# EAGLE schematic table_tiles (EAGLE 5.11)

## Sheet 1 of 2
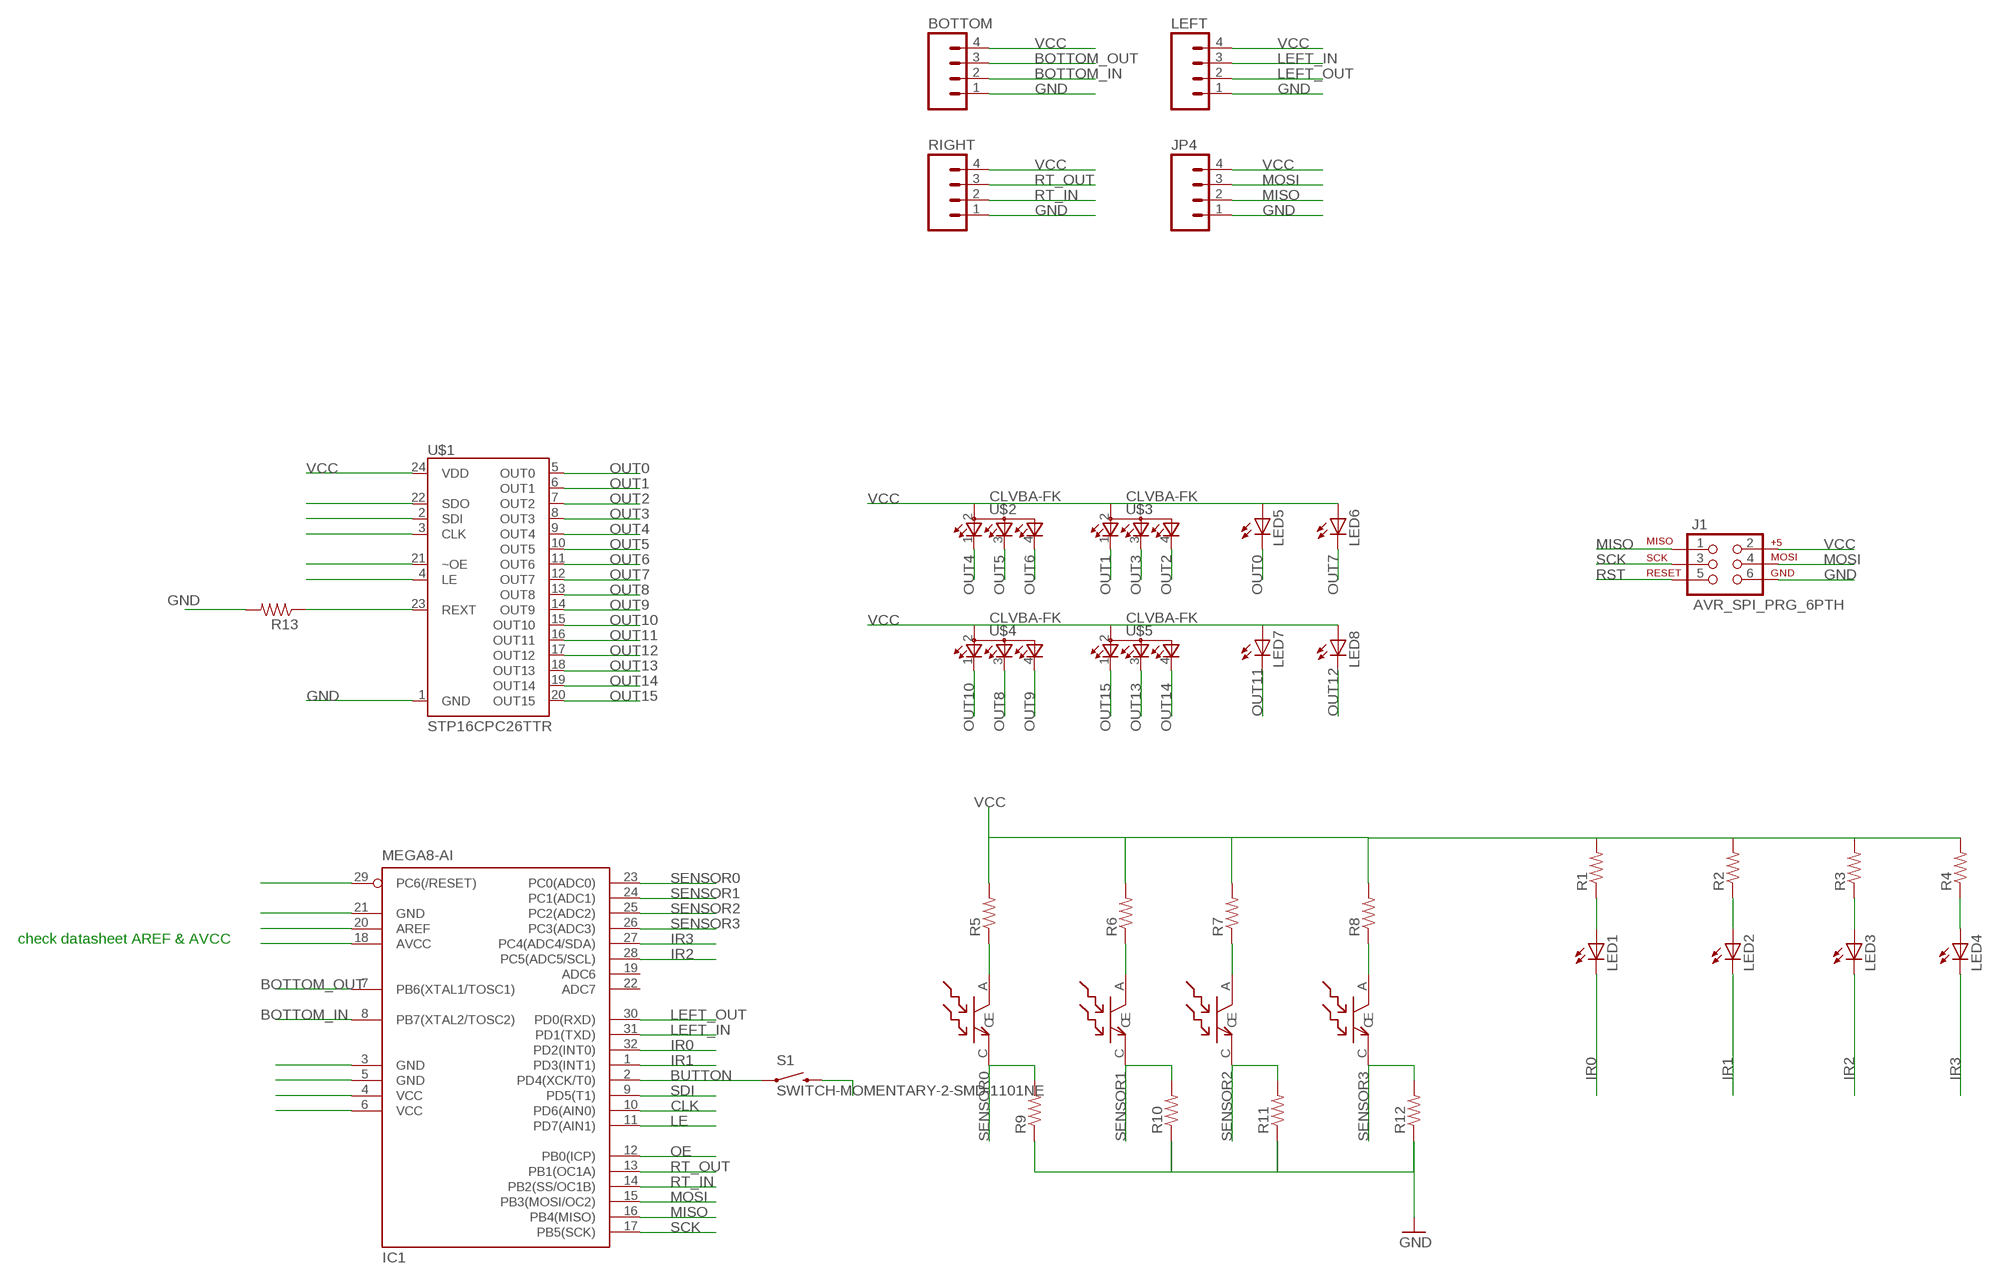
[diagram p0: schematic, sheet 1]

### Parts
BOTTOM  M04JST-PTH  [JST-4-PTH]
IC1  MEGA8-AI  [TQFP32-08]
J1  AVR_SPI_PRG_6PTH  [2X3]
JP4  M04PTH  [1X04]
LED1  LED1206  [LED-1206]
LED2  LED1206  [LED-1206]
LED3  LED1206  [LED-1206]
LED4  LED1206  [LED-1206]
LED5  LED10MM  [LED10MM]
LED6  LED10MM  [LED10MM]
LED7  LED10MM  [LED10MM]
LED8  LED10MM  [LED10MM]
LEFT  M04PTH  [1X04]
R1  RESISTOR0805-RES  [0805]
R2  RESISTOR0805-RES  [0805]
R3  RESISTOR0805-RES  [0805]
R4  RESISTOR0805-RES  [0805]
R5  RESISTOR0805-RES  [0805]
R6  RESISTOR0805-RES  [0805]
R7  RESISTOR0805-RES  [0805]
R8  RESISTOR0805-RES  [0805]
R9  RESISTOR0805-RES  [0805]
R10  RESISTOR0805-RES  [0805]
R11  RESISTOR0805-RES  [0805]
R12  RESISTOR0805-RES  [0805]
R13  RESISTOR0805-RES  [0805]
RIGHT  M04JST-PTH  [JST-4-PTH]
S1  SWITCH-MOMENTARY-2-SMD-1101NE  [TACTILE-SWITCH-1101NE]
U$1  STP16CPC26TTR  STP16CP05TSSOP  [TSSOP24]
U$2  CLVBA-FK  [PLCC4]
U$3  CLVBA-FK  [PLCC4]
U$4  CLVBA-FK  [PLCC4]
U$5  CLVBA-FK  [PLCC4]
U$6  PT26-21B  [PT26-21B]
U$7  PT26-21B  [PT26-21B]
U$8  PT26-21B  [PT26-21B]
U$9  PT26-21B  [PT26-21B]

### Nets
BOTTOM_IN: BOTTOM.2 IC1.8(PB7(XTAL2/TOSC2))
BOTTOM_OUT: BOTTOM.3 IC1.7(PB6(XTAL1/TOSC1))
BUTTON: IC1.2(PD4(XCK/T0)) S1.P$1
CLK: IC1.10(PD6(AIN0)) U$1.3(CLK)
GND: BOTTOM.1 IC1.3(GND) IC1.5(GND) IC1.21(GND) J1.6 JP4.1 LEFT.1 R9.1 R10.1 R11.1 R12.1 R13.2 RIGHT.1 S1.P$2 U$1.1(GND) ; also sheet 2
IR0: IC1.32(PD2(INT0)) LED1.C
IR1: IC1.1(PD3(INT1)) LED2.C
IR2: IC1.28(PC5(ADC5/SCL)) LED3.C
IR3: IC1.27(PC4(ADC4/SDA)) LED4.C
LE: IC1.11(PD7(AIN1)) U$1.4(LE)
LEFT_IN: IC1.31(PD1(TXD)) LEFT.3
LEFT_OUT: IC1.30(PD0(RXD)) LEFT.2
MISO: IC1.16(PB4(MISO)) J1.1 JP4.2
MOSI: IC1.15(PB3(MOSI/OC2)) J1.4 JP4.3
N$5: LED4.A R4.1
N$6: LED3.A R3.1
N$7: LED2.A R2.1
N$8: LED1.A R1.1
N$9: R5.1 U$8.A(C)
N$10: R6.1 U$9.A(C)
N$11: R7.1 U$6.A(C)
N$12: R8.1 U$7.A(C)
OE: IC1.12(PB0(ICP)) U$1.21(~OE)
OUT0: LED5.K(C) U$1.5(OUT0)
OUT1: U$1.6(OUT1) U$3.1(CRED)
OUT2: U$1.7(OUT2) U$3.4(CGREEN)
OUT3: U$1.8(OUT3) U$3.3(CBLUE)
OUT4: U$1.9(OUT4) U$2.1(CRED)
OUT5: U$1.10(OUT5) U$2.3(CBLUE)
OUT6: U$1.11(OUT6) U$2.4(CGREEN)
OUT7: LED6.K(C) U$1.12(OUT7)
OUT8: U$1.13(OUT8) U$4.3(CBLUE)
OUT9: U$1.14(OUT9) U$4.4(CGREEN)
OUT10: U$1.15(OUT10) U$4.1(CRED)
OUT11: LED7.K(C) U$1.16(OUT11)
OUT12: LED8.K(C) U$1.17(OUT12)
OUT13: U$1.18(OUT13) U$5.3(CBLUE)
OUT14: U$1.19(OUT14) U$5.4(CGREEN)
OUT15: U$1.20(OUT15) U$5.1(CRED)
REXT: R13.1 U$1.23(REXT)
RST: IC1.29(PC6(/RESET)) J1.5
RT_IN: IC1.14(PB2(SS/OC1B)) RIGHT.2
RT_OUT: IC1.13(PB1(OC1A)) RIGHT.3
SCK: IC1.17(PB5(SCK)) J1.3
SDI: IC1.9(PD5(T1)) U$1.2(SDI)
SDO: U$1.22(SDO)
SENSOR0: IC1.23(PC0(ADC0)) R9.2 U$8.C(E)
SENSOR1: IC1.24(PC1(ADC1)) R10.2 U$9.C(E)
SENSOR2: IC1.25(PC2(ADC2)) R11.2 U$6.C(E)
SENSOR3: IC1.26(PC3(ADC3)) R12.2 U$7.C(E)
VCC: BOTTOM.4 IC1.4(VCC) IC1.6(VCC) IC1.18(AVCC) IC1.20(AREF) J1.2 JP4.4 LED5.A LED6.A LED7.A LED8.A LEFT.4 R1.2 R2.2 R3.2 R4.2 R5.2 R6.2 R7.2 R8.2 RIGHT.4 U$1.24(VDD) U$2.2(A2) U$3.2(A2) U$4.2(A2) U$5.2(A2) ; also sheet 2
Unconnected: IC1.19(ADC6) IC1.22(ADC7)

### Notes on the sheet
- check datasheet AREF & AVCC

## Sheet 2 of 2
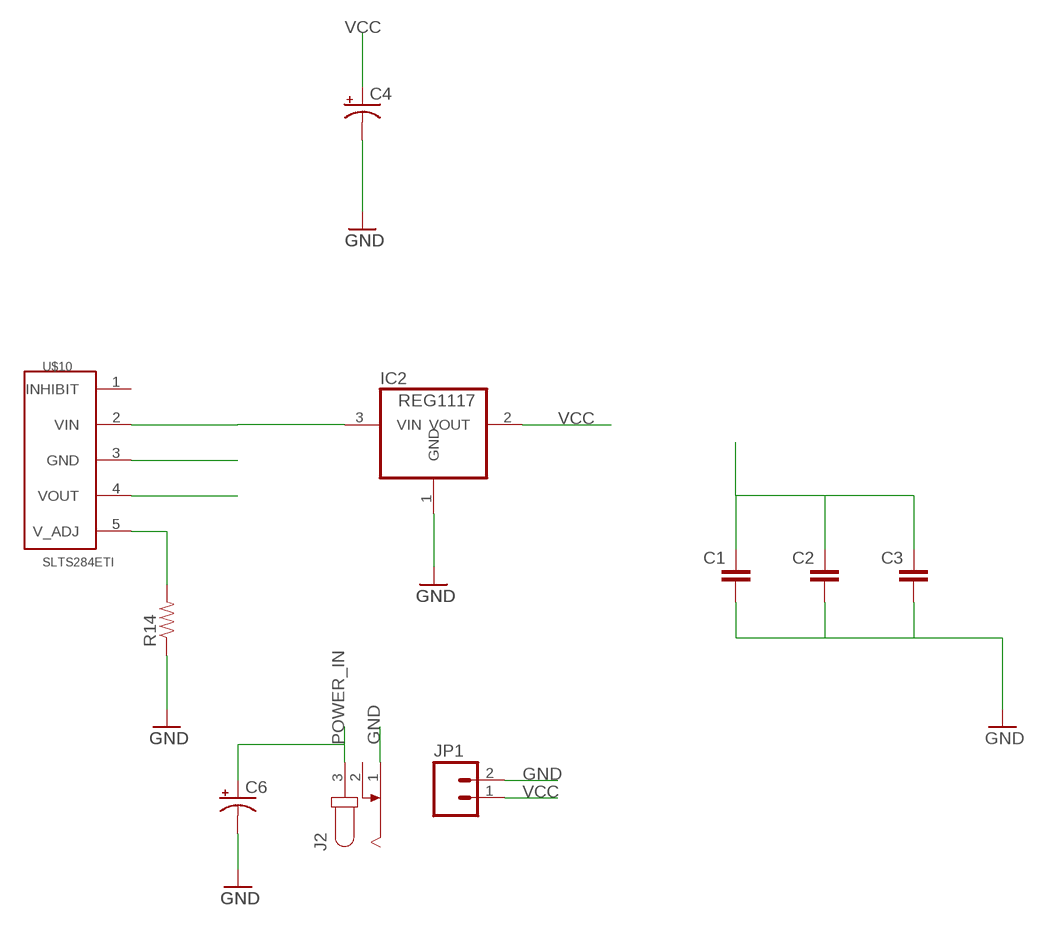
[diagram p1: schematic, sheet 2]

### Parts
C1  CAP0805  [0805]
C2  CAP0805  [0805]
C3  CAP0805  [0805]
C4  CAP_POL3528  [EIA3528]
C6  CAP_POL7343  [EIA7343]
IC2  REG1117  [SOT223]
J2  JACK-PLUG1  [SPC4078]
JP1  M023.5MM  [SCREWTERMINAL-3.5MM-2]
R14  RESISTOR0805-RES  [0805]
U$10  SLTS284ETI  [SLTS284E]

### Nets
GND: C1.2 C2.2 C3.2 C4.C(-) C6.C(-) IC2.1(GND) J2.1 JP1.2 R14.1 U$10.3(GND) ; also sheet 1
N$4: R14.2 U$10.5(V_ADJ)
POWER_IN: C6.A(+) IC2.3(VIN) J2.3 U$10.2(VIN)
VCC: C1.1 C2.1 C3.1 C4.A(+) IC2.2(VOUT) JP1.1 U$10.4(VOUT) ; also sheet 1
Unconnected: J2.2 U$10.1(INHIBIT)

## Library data of the parts
BOTTOM JP4 LEFT RIGHT = SparkFun:M04: Header 4 Standard 4-pin 0.1" header. Use with straight break away headers (SKU : PRT-00116), right angle break away headers (PRT-00553), swiss pins (PRT-00743), machine pins (PRT-00117), and female headers (PRT-00115). Molex polarized connector foot print use with SKU : PRT-08231 with associated crimp pins and housings. 1MM SMD Version SKU: PRT-10208
C1-C3 = SparkFun:CAP: Capacitor Standard 0603 ceramic capacitor, and 0.1" leaded capacitor.
C4 C6 = slice_noshift:CAP_POL: Capacitor Polarized These are standard SMD and PTH capacitors. Normally 10uF, 47uF, and 100uF in electrolytic and tantalum varieties. Always verify the external diameter of the through hole cap, it varies with capacity, voltage, and manufacturer. The EIA devices should be standard.
IC1 = atmel:MEGA8: MICROCONTROLLER 8 Kbytes FLASH, 1 kbytes SRAM, 512 bytes EEPROM, USART, 6-channel 10 bit ADC, 2-channel 8 bit ADC Pin compatible with Atmega48, ATMega88, ATMega168 Source: avr.lbr; MPN: ATMEGA8-16AU; OC_FARNELL: 9171371; OC_NEWARK: 73M8863
IC2 = burr-brown:REG1117: 800mA and 1A Low Dropout (LDO) Positive Regulator 1.8V, 2.5V, 2.85V, 3.3V, 5V, and Adj; MPN: REG1117; OC_FARNELL: 1097566; OC_NEWARK: 14P6981
J1 = SparkFun:AVR_SPI_PRG_6: AVR ISP 6 Pin This is the reduced ISP connector for AVR programming. Common on Arduino. This footprint will take up less PCB space and can be used with a 10-pin to 6-pin adapter such as SKU: BOB-08508
J2 = con-jack:JACK-PLUG: DC POWER JACK Power Jack, DC, Right Angle, Through Hole, Rated 5A at 16VDC, PC Terminals Distributor: Farnell (www.Farnell.de) Drawing: 84N1161.pdf / 84N1162.pdf Manufacturer: SPC Technology (www.spctechnology.com) Type: SPC4077 / SPC 4078; OC_FARNELL: unknown; OC_NEWARK: unknown
JP1 = SparkFun:M02: Header 2 Standard 2-pin 0.1" header. Use with straight break away headers (SKU : PRT-00116), right angle break away headers (PRT-00553), swiss pins (PRT-00743), machine pins (PRT-00117), and female headers (PRT-00115). Molex polarized connector foot print use with SKU : PRT-08233 with associated crimp pins and housings.
LED1-LED4 = table_tiles:LED: LEDs Standard schematic elements and footprints for 5mm, 3mm, 1206, and 0603 sized LEDs. 5mm - Spark Fun Electronics SKU : COM-00529 (and others)
LED5-LED8 = led:LED: LED OSRAM: - CHIPLED LG R971, LG N971, LY N971, LG Q971, LY Q971, LO R971, LY R971 LH N974, LH R974 LS Q976, LO Q976, LY Q976 LO Q996 - Hyper CHIPLED LW Q18S LB Q993, LB Q99A, LB R99A - SideLED LS A670, LO A670, LY A670, LG A670, LP A670 LB A673, LV A673, LT A673, LW A673 LH A674 LY A675 LS A676, LA A676, LO A676, LY A676, LW A676 LS A679, LY A679, LG A679 - Hyper Micro SIDELED® LS Y876, LA Y876, LO Y876, LY Y876 LT Y87S - SmartLED LW L88C, LW L88S LB L89C, LB L89S, LG L890 LS L89K, LO L89K, LY L89K LS L896, LA L896, LO L896, LY L896 - TOPLED LS T670, LO T670, LY T670, LG T670, LP T670 LSG T670, LSP T670, LSY T670, LOP T670, LYG T670 LG T671, LOG T671, LSG T671 LB T673, LV T673, LT T673, LW T673 LH T674 LS T676, LA T676, LO T676, LY T676, LB T676, LH T676, LSB T676, LW T676 LB T67C, LV T67C, LT T67C, LS T67K, LO T67K, LY T67K, LW E67C LS E67B, LA E67B, LO E67B, LY E67B, LB E67C, LV E67C, LT E67C LW T67C LS T679, LY T679, LG T679 LS T770, LO T770, LY T770, LG T770, LP T770 LB T773, LV T773, LT T773, LW T773 LH T774 LS E675, LA E675, LY E675, LS T675 LS T776, LA T776, LO T776, LY T776, LB T776 LHGB T686 LT T68C, LB T68C - Hyper Mini TOPLED® LB M676 - Mini TOPLED Santana® LG M470 LS M47K, LO M47K, LY M47K Source: http://www.osram.convergy.de LUXEON: - LUMILED® LXK2-PW12-R00, LXK2-PW12-S00, LXK2-PW14-U00, LXK2-PW14-V00 LXK2-PM12-R00, LXK2-PM12-S00, LXK2-PM14-U00 LXK2-PE12-Q00, LXK2-PE12-R00, LXK2-PE12-S00, LXK2-PE14-T00, LXK2-PE14-U00 LXK2-PB12-K00, LXK2-PB12-L00, LXK2-PB12-M00, LXK2-PB14-N00, LXK2-PB14-P00, LXK2-PB14-Q00 LXK2-PR12-L00, LXK2-PR12-M00, LXK2-PR14-Q00, LXK2-PR14-R00 LXK2-PD12-Q00, LXK2-PD12-R00, LXK2-PD12-S00 LXK2-PH12-R00, LXK2-PH12-S00 LXK2-PL12-P00, LXK2-PL12-Q00, LXK2-PL12-R00 Source: www.luxeon.com KINGBRIGHT: KA-3528ASYC Source: www.kingbright.com
R1-R14 = SparkFun:RESISTOR: Resistor Basic schematic elements and footprints for 0603, 1206, and PTH resistors.
S1 = SparkFun:SWITCH-MOMENTARY-2
U$1 = table_tiles:STP16CP05
U$2-U$5 = rf_blinky:CLVBA-FK
U$6-U$9 = table_tiles:PT26-21B
U$10 = PWM:SLTS284E